# EAGLE design RFID_13.55_ant_v1.1 (EAGLE 8.0.1)

## Sheet 1 of 2: RFID_13.55_ant_v1
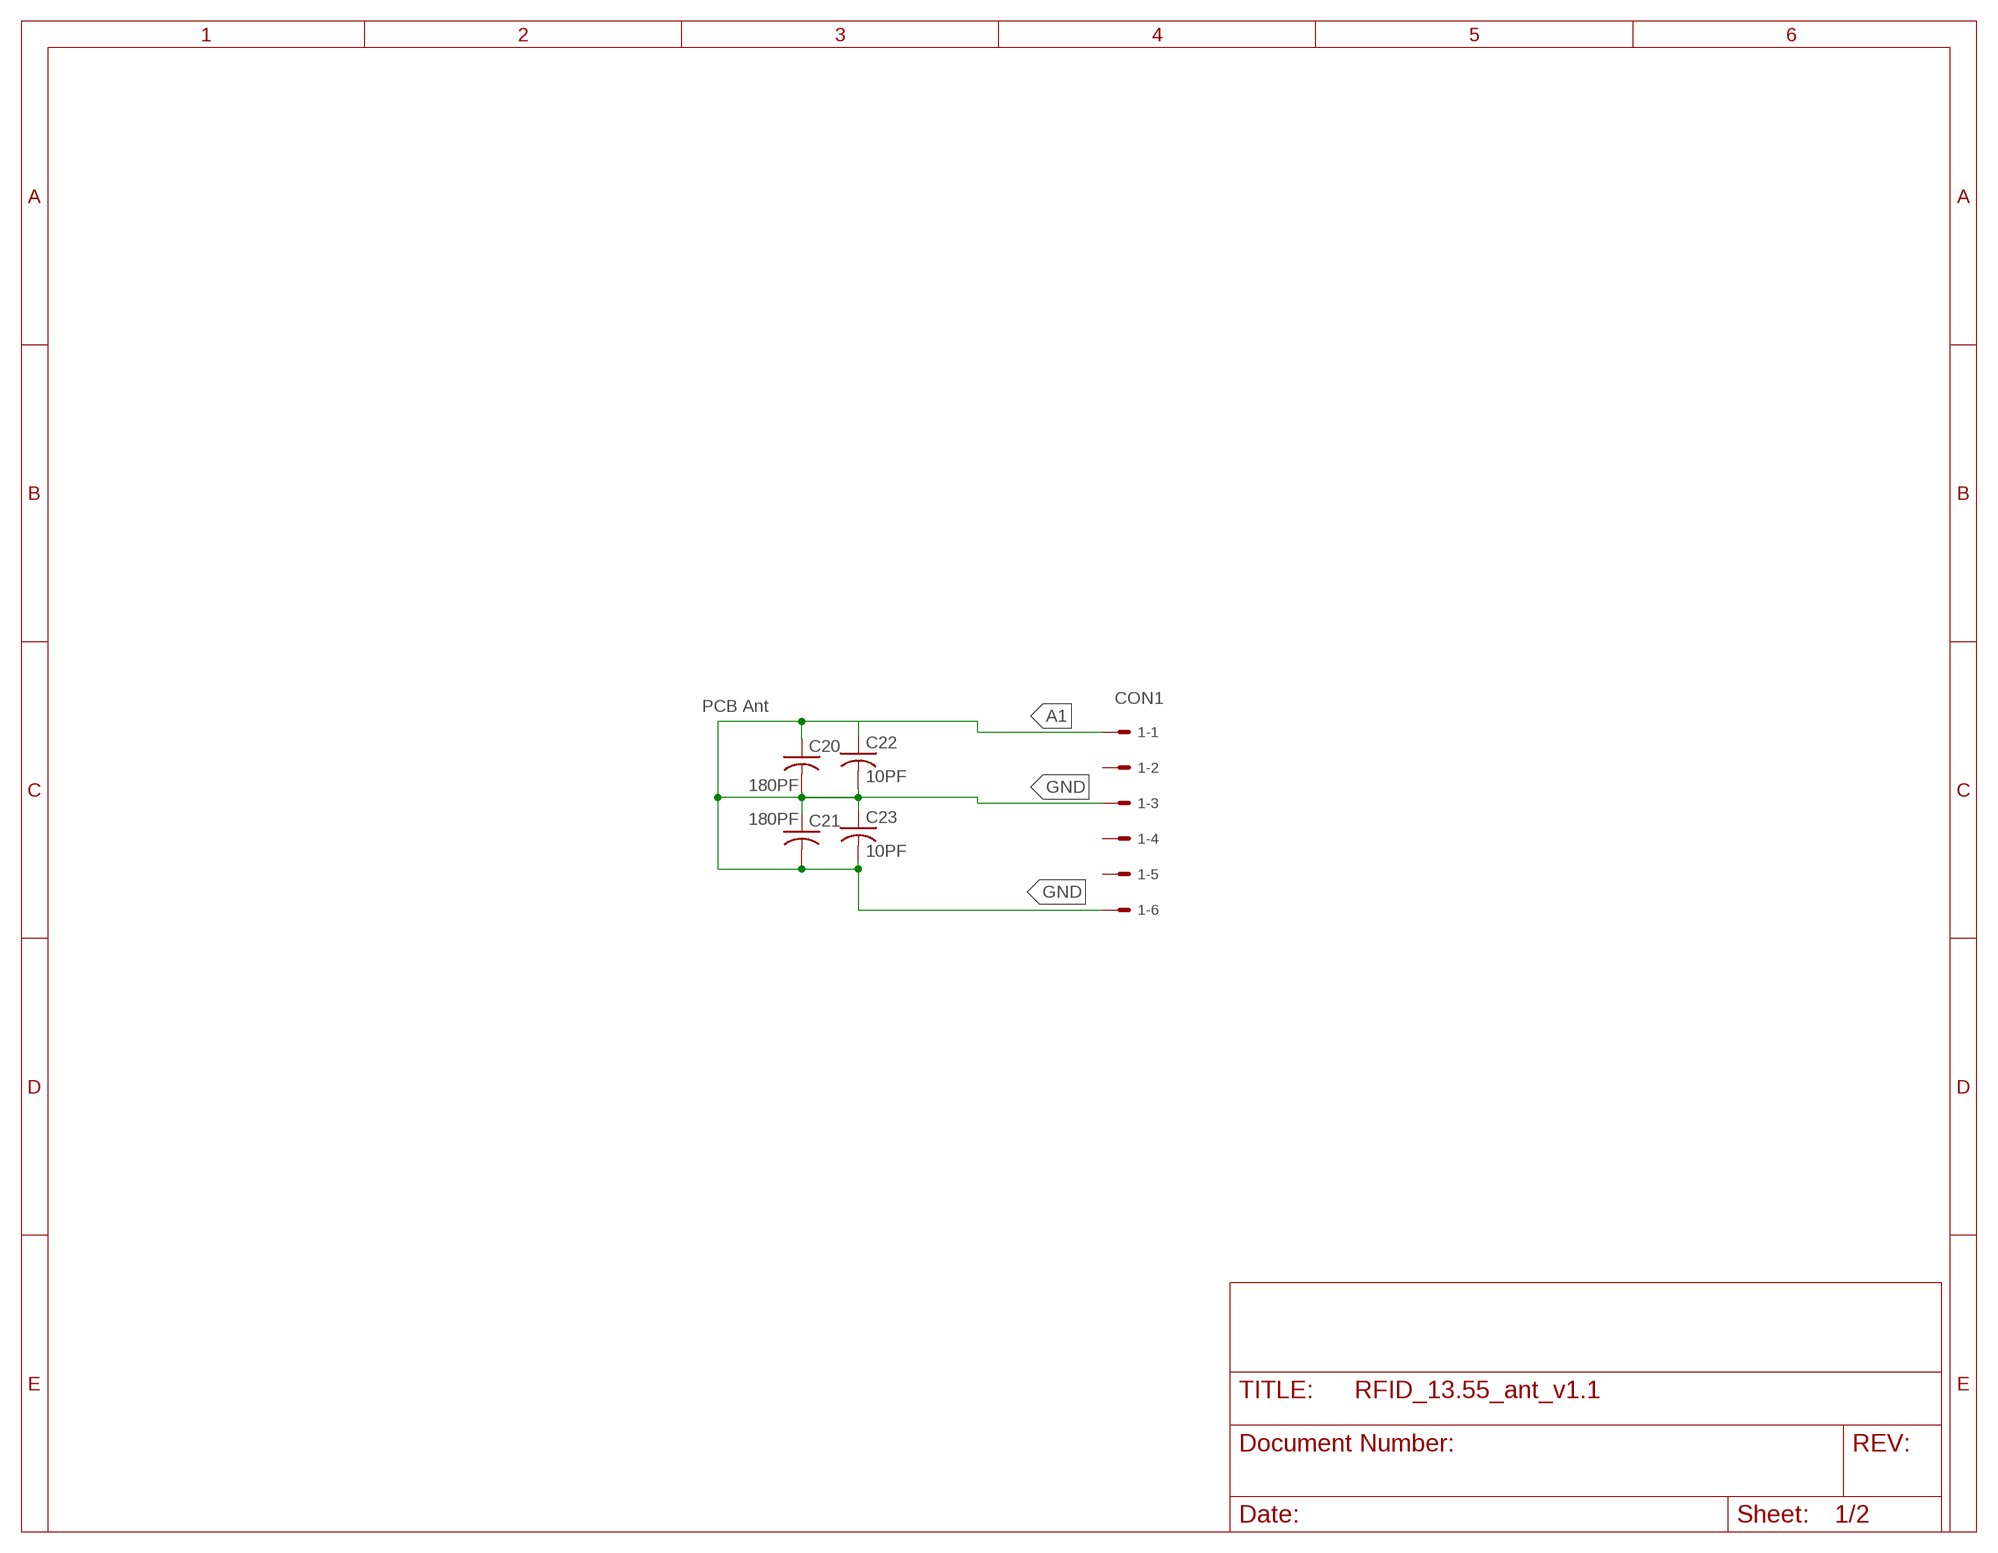
[diagram p0: schematic, sheet 1]

### Parts
1  CON1  22-27-2061-06  [6410-06]
C20  180PF  C-USC0603  [C0603]
C21  180PF  C-USC0603  [C0603]
C22  10PF  C-USC0603  [C0603]
C23  10PF  C-USC0603  [C0603]

### Nets
A1: 1.1 C20.1 C22.1
GND: 1.3 1.6 C20.2 C21.1 C21.2 C22.2 C23.1 C23.2
Unconnected: 1.2 1.4 1.5

### Notes on the sheet
- PCB Ant

## Sheet 2 of 2: Notes
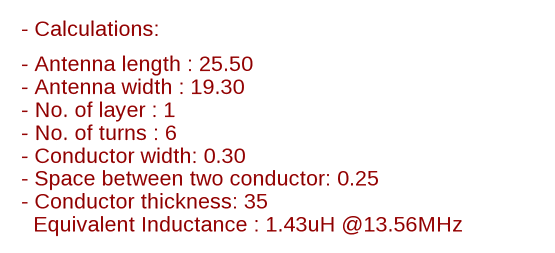
[diagram p1: schematic, sheet 2]

### Notes on the sheet
- - Calculations:
- - Antenna length : 25.50
  - Antenna width : 19.30
  - No. of layer : 1
  - No. of turns : 6
  - Conductor width: 0.30
  - Space between two conductor: 0.25
  - Conductor thickness: 35
    Equivalent Inductance : 1.43uH @13.56MHz

## Library data of the parts
1 = con-molex:22-?-06: CONNECTOR wire to board 2.54 mm (.1 inch) pitch header; OC_FARNELL: unknown; OC_NEWARK: unknown
C20-C23 = resistor:C-US: CAPACITOR, American symbol

## Board
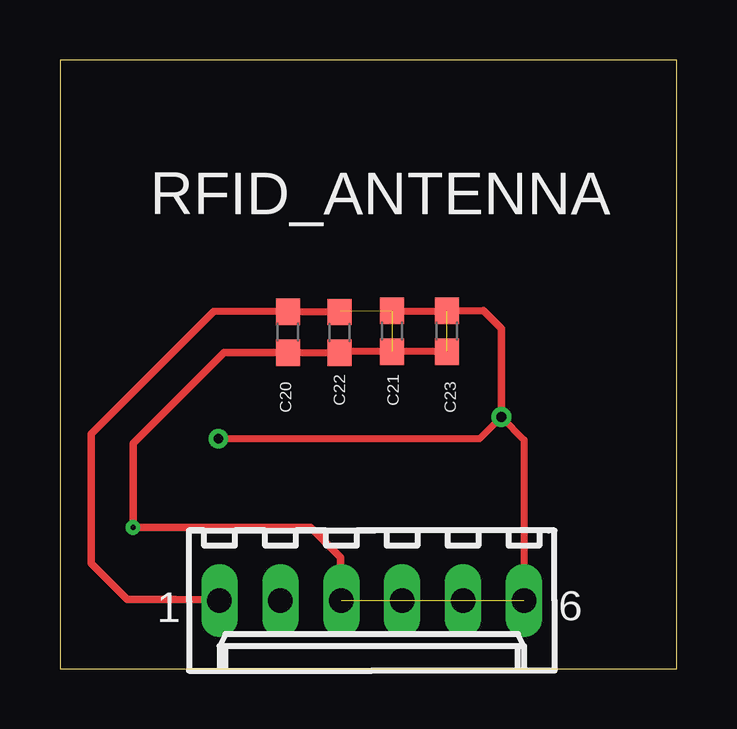
[diagram p2: board, top side]
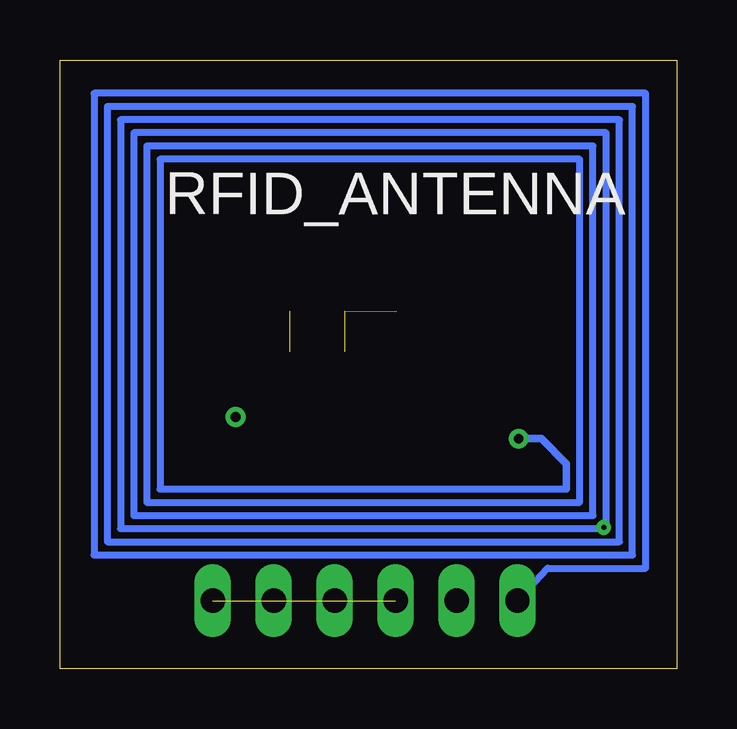
[diagram p3: board, bottom side, seen from below]

Size 25.72 x 25.39 mm. Coordinates in mm from the lower left corner, seen from the top.
Outline: 0,0 25.72,0 25.72,25.39 0,25.39 0,0
Copper layers (1*16): Top 0.035mm / dielectric 1.5mm / Bottom 0.035mm
Design rules "default": minimum track width 10mil, minimum drill 24mil, track to track 8mil, track to pad 8mil, pad to pad 8mil, via to via 8mil, smd to smd 8mil, copper to edge 40mil, drill to drill 8mil, minimum pad ring 10mil, minimum via ring 8mil, stop-mask expansion 4mil, vias tented up to drill 0mil, thermal gap 10mil

### Footprints (pad centres in the part's own frame; a part is rotated, then mirrored left to right if it is on the bottom)
6410-06 = drill 1.016 long: 1 6.35,0; 2 3.81,0; 3 1.27,0; 4 -1.27,0; 5 -3.81,0; 6 -6.35,0
C0603 = smd 1.1 x 1: 1 -0.85,0; 2 0.85,0

### Placement (x,y rotation side)
1  13,2.85 180 top
C20  9.5,14.04 270 top
C21  13.85,14.08 90 top
C22  11.65,14.03 270 top
C23  16.13,14.08 90 top

### Tracks (layer width: path | path; a pad name or v marks a point on that pad's centre or on a via)
A1  (via drill 0.4, 0.42 pad 0.41)  (1 unrouted)
  Top 0.3: v6.6,9.6 17.5,9.6 v18.4,10.5 19.35,9.55 19.35,2.8 | 16.1,14.95 17.65,14.95 | 16.12,14.93 16.1,14.95 | 11.7,14.93 C22.1 C20.1 | 16.1,14.95 16.05,14.9 13.85,14.9
  Top 0.305: 17.65,14.95 18.4,14.2 v18.4,10.5
  Bottom 0.3: 1.1 5.4,4.2 1.3,4.2 1.3,24 24.3,24 24.3,4.75 1.85,4.75 1.85,23.45 23.75,23.45 23.75,5.3 2.4,5.3 2.4,22.9 23.2,22.9 23.2,5.85 2.95,5.85 2.95,22.35 22.65,22.35 22.65,6.4 3.5,6.4 3.5,21.8 22.1,21.8 22.1,6.95 4.05,6.95 4.05,21.25 21.55,21.25 21.55,7.5 4.6,7.5
  Bottom 0.305: 4.6,7.5 4.6,8.55 5.65,9.6 v6.6,9.6
GND  (via drill 0.2)  (3 unrouted)
  Top 0.3: C23.1 C21.1 11.7,13.23 C22.2 C20.2
  Top 0.305: C20.2 6.85,13.2 3.05,9.4 v3.05,5.9 10.45,5.9 11.7,4.65 11.7,2.88 1.3
N$1
  Top 0.3: 4.8,2.9 6.6,2.9 6.65,2.85 | 9.5,14.9 6.4,14.9
  Top 0.305: 6.4,14.9 1.3,9.8 1.3,4.4 2.8,2.9 4.8,2.9

### Text on the board
tNames: RFID_ANTENNA
bNames: RFID_ANTENNA